# Altium schematic sheet PIC18F2550_Schematic.SchDoc: PIC18F2550 Development Board
size A4; DrawnBy: Süleyman YÜKSELDİ; Time: 09.07.2018
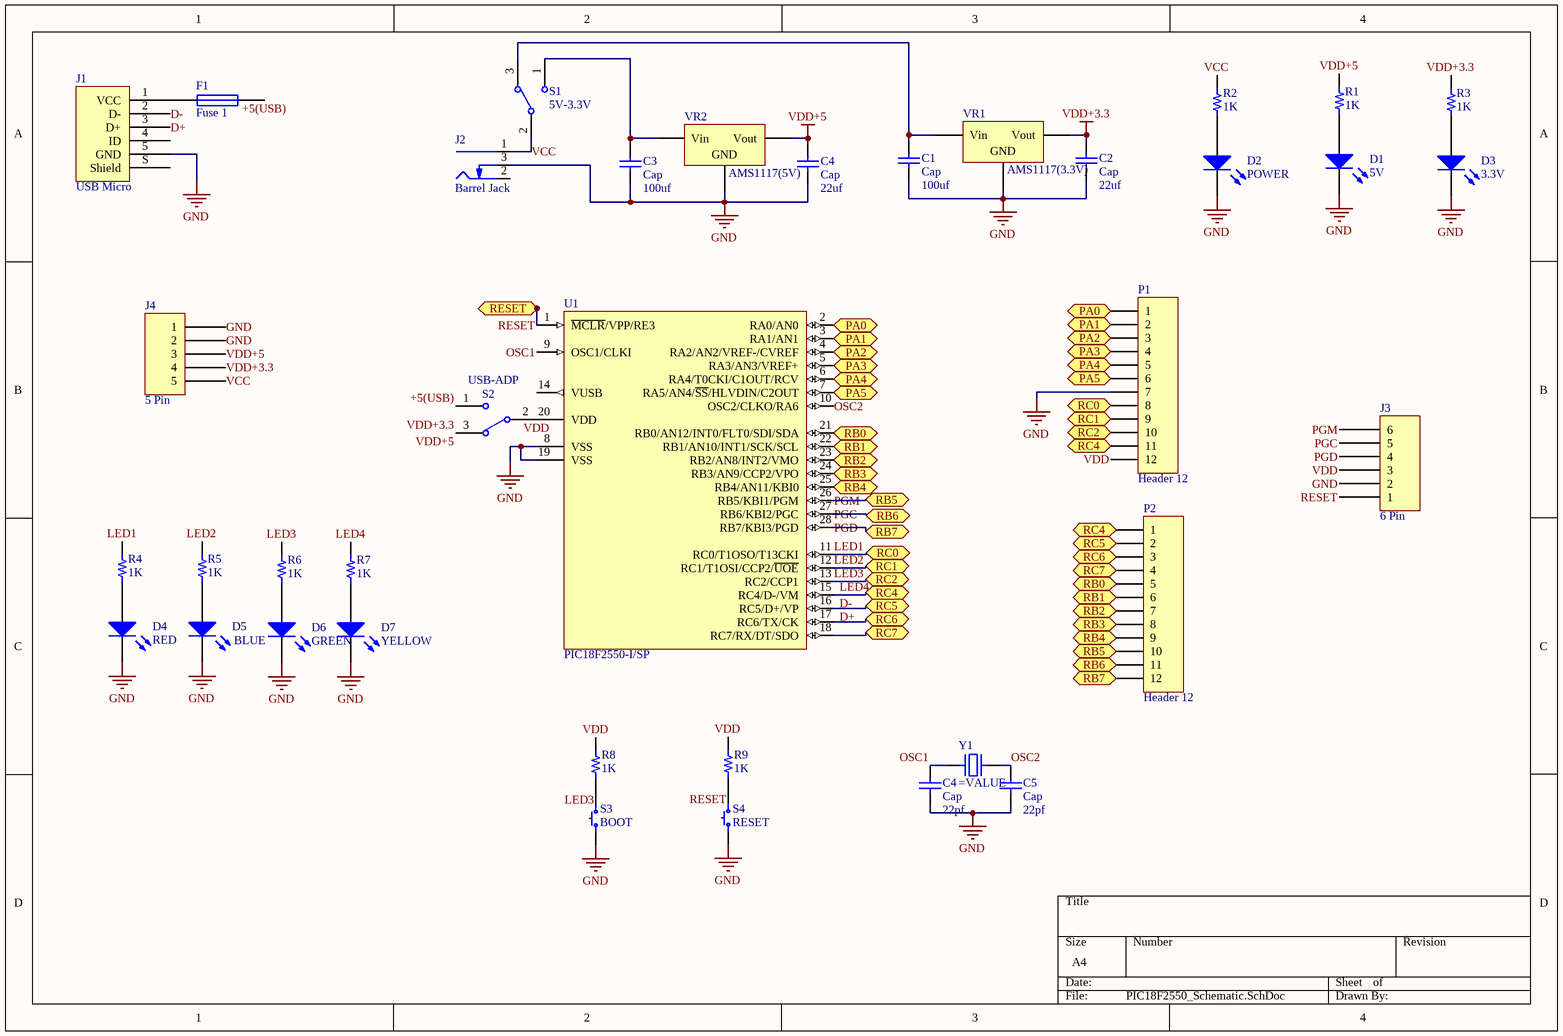
[diagram p0: PIC18F2550_Schematic.SchDoc]

## Parts
(Parts that share a designator on the sheet are numbered #1, #2 ... from top to bottom, then left to right.)
C1  Cap  value 100uf  [CAP 0805/2012]
C2  Cap  value 22uf  [CAP 0805/2012]
C3  Cap  value 100uf  [CAP 0805/2012]
C4#1  Cap  value 22uf  [CAP 0805/2012]
C4#2  Cap  value 22pf  [CAP 0805/2012]
C5  Cap  value 22pf  [CAP 0805/2012]
D1  5V  [LED 0805/2012 BLUE]
D2  POWER  [LED 0805/2012 RED]
D3  3.3V  [LED 0805/2012 YELLOW]
D4  RED  [LED 0805/2012 RED]
D5  BLUE  [LED 0805/2012 BLUE]
D6  GREEN  [LED 0805/2012 GREEN]
D7  YELLOW  [LED 0805/2012 YELLOW]
F1  Fuse 1  [MSMF075]
J1  USB Micro  [FCI USB 10118193-0001LF]
J2  Barrel Jack  [CUI PJ-102AH]
J3  6 Pin  [Male_1X6]
J4  5 Pin  [Female_1X5]
P1  Header 12  [Female_1X12]
P2  Header 12  [Female_1X12]
R1  1K  [RES 0805/2012]
R2  1K  [RES 0805/2012]
R3  1K  [RES 0805/2012]
R4  1K  [RES 0805/2012]
R5  1K  [RES 0805/2012]
R6  1K  [RES 0805/2012]
R7  1K  [RES 0805/2012]
R8  1K  [RES 0805/2012]
R9  1K  [RES 0805/2012]
S1  5V-3.3V  [450301014042]
S2  USB-ADP  [450301014042]
S3  BOOT  [430152043836]
S4  RESET  [430152043836]
U1  PIC18F2550-I/SP  [DIP-28]
VR1  AMS1117(3.3V)  [ST SOT-223]
VR2  AMS1117(5V)  [ST SOT-223]
Y1  (no value)  [TXC 9C]

## Ports
PA0 (bidir), PA1 (bidir), PA2 (bidir), PA3 (bidir), PA4 (bidir), PA5 (bidir), RB0 (bidir), RB1 (bidir), RB2 (bidir), RB3 (bidir), RB4 (bidir), RB5 (bidir), RB6 (bidir), RB7 (bidir), RC0 (bidir), RC1 (bidir), RC2 (bidir), RC4 (bidir), RC5 (bidir), RC6 (bidir), RC7 (bidir), RESET (bidir)

## Nets
GND: C1.1 C2.1 C3.1 C4#1.1 C4#2.1 C5.1 D1.2(K) D2.2(K) D3.2(K) D4.2(K) D5.2(K) D6.2(K) D7.2(K) J1.5(GND) J2.3(SW) J3.2 J4.1 J4.2 P1.7 S3.1 S4.1 U1.8(VSS) U1.19(VSS) VR1.2(GND) VR2.2(GND)
VDD+3.3: C2.2 C4#1.2 J4.3 J4.4 R1.1 R3.1 S2.3 VR1.3(Vout) VR2.3(Vout)  [also labelled VDD+5]
+5(USB): F1.2 S2.1
D+: J1.3(D+) P2.2 U1.16(RC5/D+/VP) ; port RC5
D-: J1.2(D-) P1.11 P2.1 R7.1 U1.15(RC4/D-/VM) ; port RC4  [also labelled LED4]
LED1: P1.8 R4.1 U1.11(RC0/T1OSO/T13CKI) ; port RC0
LED2: P1.9 R5.1 U1.12(RC1/T1OSI/CCP2/~{UOE}) ; port RC1
LED3: P1.10 R6.1 R8.1 S3.3 U1.13(RC2/CCP1) ; port RC2
OSC1: C4#2.2 U1.9(OSC1/CLKI) Y1.1
OSC2: C5.2 U1.10(OSC2/CLKO/RA6) Y1.2
PA0: P1.1 U1.2(RA0/AN0) ; port PA0
PA1: P1.2 U1.3(RA1/AN1) ; port PA1
PA2: P1.3 U1.4(RA2/AN2/VREF-/CVREF) ; port PA2
PA3: P1.4 U1.5(RA3/AN3/VREF+) ; port PA3
PA4: P1.5 U1.6(RA4/T0CKI/C1OUT/RCV) ; port PA4
PA5: P1.6 U1.7(RA5/AN4/~{SS}/HLVDIN/C2OUT) ; port PA5
PGC: J3.5 P2.11 U1.27(RB6/KBI2/PGC) ; port RB6
PGD: J3.4 P2.12 U1.28(RB7/KBI3/PGD) ; port RB7
PGM: J3.6 P2.10 U1.26(RB5/KBI1/PGM) ; port RB5
RB0: P2.5 U1.21(RB0/AN12/INT0/FLT0/SDI/SDA) ; port RB0
RB1: P2.6 U1.22(RB1/AN10/INT1/SCK/SCL) ; port RB1
RB2: P2.7 U1.23(RB2/AN8/INT2/VMO) ; port RB2
RB3: P2.8 U1.24(RB3/AN9/CCP2/VPO) ; port RB3
RB4: P2.9 U1.25(RB4/AN11/KBI0) ; port RB4
RC6: P2.3 U1.17(RC6/TX/CK) ; port RC6
RC7: P2.4 U1.18(RC7/RX/DT/SDO) ; port RC7
RESET: J3.1 R9.1 S4.3 U1.1(~{MCLR}/VPP/RE3) ; port RESET
VCC: J2.1(Centre) J4.5 R2.1 S1.2
VDD: J3.3 P1.12 R8.2 R9.2 S2.2 U1.20(VDD)
NetC1_2: C1.2 S1.3 VR1.1(Vin)
NetC3_2: C3.2 S1.1 VR2.1(Vin)
NetD1_1: D1.1(A) R1.2
NetD2_1: D2.1(A) R2.2
NetD3_1: D3.1(A) R3.2
NetD4_1: D4.1(A) R4.2
NetD5_1: D5.1(A) R5.2
NetD6_1: D6.1(A) R6.2
NetD7_1: D7.1(A) R7.2
NetF1_1: F1.1 J1.1(VCC)

Not connected (* = marked no-connect by the designer): J1 4(ID) S(Shield); J2 2(Outer); U1 14(VUSB)

## Library data of the parts
C1-C3 C4#1 C4#2 C5 = Cap: Capacitor; Published: 8-Jun-2000; LatestRevisionDate: 17-Jul-2002; LatestRevisionNote: Re-released for DXP Platform.; PackageReference: RAD-0.3; Publisher: Altium Limited; PackageDescription: Radial Cap, Thru-Hole; 2 Leads; 0.3 in Pin Spacing
D1-D7 = LED0: Typical INFRARED GaAs LED; Published: 8-Jun-2000; LatestRevisionDate: 08-Jul-2005; LatestRevisionNote: Mech Layer 1 removed.; PackageReference: LED-0; Publisher: Altium Limited; PackageDescription: LED; 2 Leads
F1 = Fuse 1: Fuse; Published: 8-Jun-2000; LatestRevisionDate: 17-Jul-2002; LatestRevisionNote: Re-released for DXP Platform.; PackageReference: PIN-W2/E2.8; Publisher: Altium Limited; PackageDescription: Thru-Hole; 2 Leads
J1 = USB 2.0 Type B Micro
J2 = Barrel Connector
P1 P2 = Header 12: Header, 12-Pin; LatestRevisionDate: 17-Jul-2002; LatestRevisionNote: Re-released for DXP Platform.; Publisher: Altium Limited
R1-R9 = Resistor: SMT Resistor; Value: 1K
S1 S2 = SW-SPDT: SPDT Subminiature Toggle Switch, Right Angle Mounting, Vertical Actuation; pin to pad: 1>2 2>1; Published: 24-Mar-1999; LatestRevisionDate: 17-Dec-2003; LatestRevisionNote: Schematic revised, PCB Footprint replaced.; DatasheetVersion: 05-Dec-2000; PackageReference: TL36WW15050; Publisher: Altium Limited; PackageDescription: Switch; 4 Leads; ComponentLink1Description: Manufacturer Link; ComponentLink1URL: http://www.apem.com
S3 S4 = NKK AB11AH-HA
U1 = PIC18F2550-I/SP: High Performance, Enhanced Flash, USB Microcontroller with nanoWatt Technology, 32K Flash, 28-Pin SPDIP, Industrial Temperature Range; Manufacturer: Microchip; DatasheetVersion: revE, Aug-2008; PackageVersion: revBB, Aug-2009; PackageReference: SPDIP300-SP28; PackageDescription: 28-Lead Skinny Plastic Dual In-Line (SP) - 300 mil Body [SPDIP]; PartNumber: PIC18F2550-I/SP; ComponentLink1Description: Manufacturer URL; ComponentLink1URL: http://www.microchip.com/; ComponentLink2Description: Datasheet; ComponentLink2URL: http://ww1.microchip.com/downloads/en/DeviceDoc/39632e.pdf; ComponentLink3Description: Package Specification; ComponentLink3URL: http://www.microchip.com/stellent/groups/techpub_sg/documents/packagingspec/en012702.pdf
VR1 VR2 = Volt Reg: Voltage Regulator; Published: 24-Mar-1999; LatestRevisionDate: 29-May-2009; LatestRevisionNote: IPC-7351 Footprint Added.; PackageReference: D2PAK; Publisher: Altium Limited; PackageDescription: 3-Pin Transistor Outline Package 2.54 mm Pitch, 15.1 mm Lead Span
Y1 = Abracon Crystal ABLS: SMT Crystal